# EAGLE design SCHEM2 (EAGLE 7.2.0)
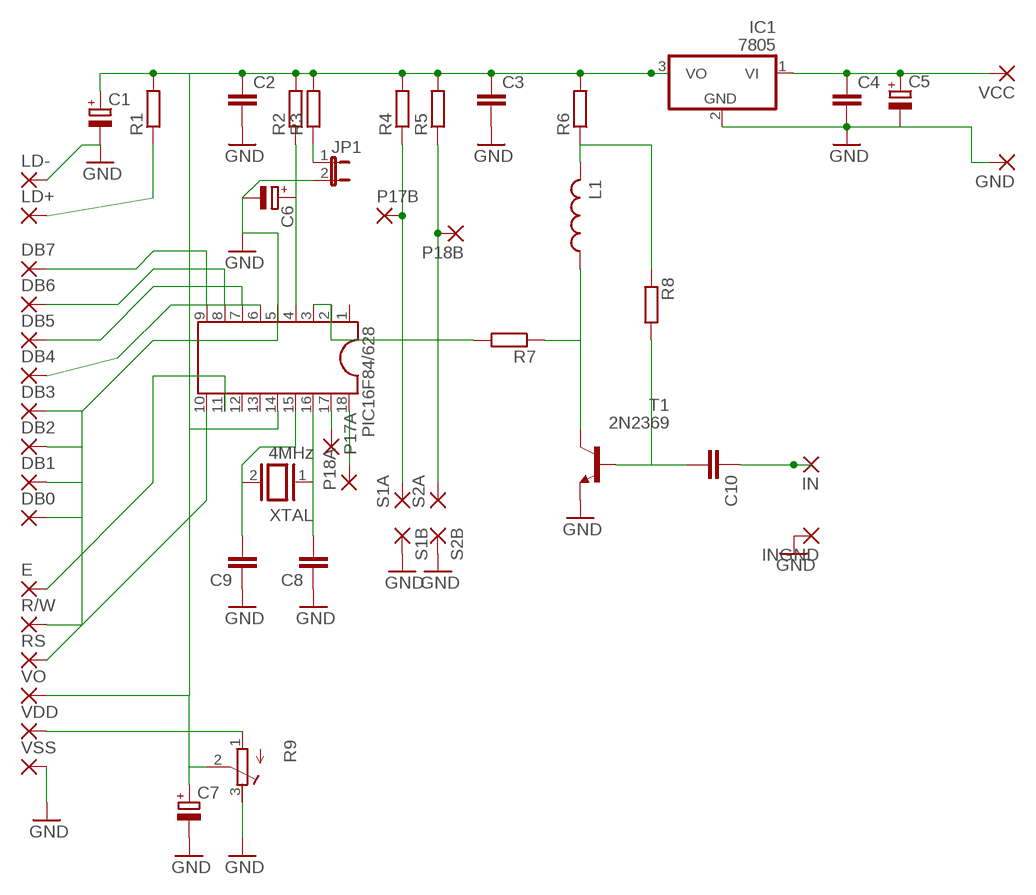
[diagram p0: schematic, sheet 1]

## Parts
C1  CPOL-EUE3.5-8  [E3,5-8]
C2  C-EU025-040X050  [C025-040X050]
C3  C-EU025-040X050  [C025-040X050]
C4  C-EU025-040X050  [C025-040X050]
C5  CPOL-EUE3.5-8  [E3,5-8]
C6  CPOL-EUE3.5-8  [E3,5-8]
C7  CPOL-EUE3.5-8  [E3,5-8]
C8  C-EU025-040X050  [C025-040X050]
C9  C-EU025-040X050  [C025-040X050]
C10  C-EU025-040X050  [C025-040X050]
DB0  WIREPAD1,6/0,8  [1,6/0,8]
DB1  WIREPAD1,6/0,8  [1,6/0,8]
DB2  WIREPAD1,6/0,8  [1,6/0,8]
DB3  WIREPAD1,6/0,8  [1,6/0,8]
DB4  WIREPAD1,6/0,8  [1,6/0,8]
DB5  WIREPAD1,6/0,8  [1,6/0,8]
DB6  WIREPAD1,6/0,8  [1,6/0,8]
DB7  WIREPAD1,6/0,8  [1,6/0,8]
E  WIREPAD1,6/0,8  [1,6/0,8]
GND  WIREPAD1,6/0,8  [1,6/0,8]
IC1  7805  788TV  [TO220V]
IN  WIREPAD1,6/0,8  [1,6/0,8]
INGND  WIREPAD1,6/0,8  [1,6/0,8]
JP1  JP1E  [JP1]
L1  L-US0204/7  [0204/7]
LD+  WIREPAD1,6/0,8  [1,6/0,8]
LD-  WIREPAD1,6/0,8  [1,6/0,8]
P17A  WIREPAD1,6/0,8  [1,6/0,8]
P17B  WIREPAD1,6/0,8  [1,6/0,8]
P18A  WIREPAD1,6/0,8  [1,6/0,8]
P18B  WIREPAD1,6/0,8  [1,6/0,8]
PIC16F84/628  DIL18  [DIL18]
R1  R-EU_0204/5  [0204/5]
R2  R-EU_0204/5  [0204/5]
R3  R-EU_0204/5  [0204/5]
R4  R-EU_0204/5  [0204/5]
R5  R-EU_0204/5  [0204/5]
R6  R-EU_0204/5  [0204/5]
R7  R-EU_0204/5  [0204/5]
R8  R-EU_0204/5  [0204/5]
R9  R-TRIMM3339P  [RTRIM3339P]
R/W  WIREPAD1,6/0,8  [1,6/0,8]
RS  WIREPAD1,6/0,8  [1,6/0,8]
S1A  WIREPAD1,6/0,8  [1,6/0,8]
S1B  WIREPAD1,6/0,8  [1,6/0,8]
S2A  WIREPAD1,6/0,8  [1,6/0,8]
S2B  WIREPAD1,6/0,8  [1,6/0,8]
T1  2N2369  [TO18]
VCC  WIREPAD1,6/0,8  [1,6/0,8]
VDD  WIREPAD1,6/0,8  [1,6/0,8]
VO  WIREPAD1,6/0,8  [1,6/0,8]
VSS  WIREPAD1,6/0,8  [1,6/0,8]
XTAL  4MHz  XTAL/S  [QS]

## Nets
GND: C1.- C2.2 C3.2 C4.2 C5.- C6.- C7.- C8.1 C9.1 DB0.1(P) DB1.1(P) DB2.1(P) DB3.1(P) GND.1(P) IC1.2(GND) INGND.1(P) JP1.2 LD-.1(P) PIC16F84/628.5 R9.3(E) R/W.1(P) S1B.1(P) S2B.1(P) T1.1(E) VSS.1(P)
N$1: C1.+ C2.1 C3.1 C7.+ IC1.3(VO) PIC16F84/628.14 R1.2 R2.2 R3.2 R4.2 R5.2 R6.2 R9.2(S) VO.1(P)
N$2: L1.2 R6.1 R8.1
N$3: C4.1 C5.+ IC1.1(VI) VCC.1(P)
N$4: JP1.1 R3.1
N$5: L1.1 R7.1 T1.3(C)
N$6: C10.2 R8.2 T1.2(B)
N$7: C10.1 IN.1(P)
N$8: DB4.1(P) PIC16F84/628.6
N$9: DB5.1(P) PIC16F84/628.7
N$10: LD+.1(P) R1.1
N$11: C6.+ PIC16F84/628.4 R2.1
N$12: DB6.1(P) PIC16F84/628.8
N$13: DB7.1(P) PIC16F84/628.9
N$14: PIC16F84/628.2 PIC16F84/628.3 R7.2
N$15: C9.2 PIC16F84/628.15 XTAL.2
N$16: C8.2 PIC16F84/628.16 XTAL.1
N$17: P18B.1(P) R5.1 S2A.1(P)
N$18: P17B.1(P) R4.1 S1A.1(P)
N$19: PIC16F84/628.10 RS.1(P)
N$20: P17A.1(P) PIC16F84/628.17
N$21: P18A.1(P) PIC16F84/628.18
N$22: R9.1(A) VDD.1(P)
N$24: E.1(P) PIC16F84/628.11
Unconnected: PIC16F84/628.1 PIC16F84/628.12 PIC16F84/628.13

## Library data of the parts
C1 C5-C7 = rcl:CPOL-EU: POLARIZED CAPACITOR, European symbol
C2-C4 C8-C10 = resistor:C-EU: CAPACITOR, European symbol
DB0 DB1-DB7 E GND IN INGND LD+ LD- P17A P17B P18A P18B R/W RS S1A S1B S2A S2B VCC VDD VO VSS = wirepad:WIREPAD: Wire PAD connect wire on PCB
IC1 = linear:78*: Positive VOLTAGE REGULATOR Source: http://cache.national.com/ds/LM/LM78L05.pdf http://www.fairchildsemi.com/ds/LM/LM7805.pdf
JP1 = jumper:JP1E: JUMPER
L1 = resistor:L-US: INDUCTOR, American symbol
PIC16F84/628 = ic-package:DIL18: Dual In Line / Socket
R1-R8 = resistor:R-EU_: RESISTOR, European symbol
R9 = rcl:R-TRIMM: Trimm resistor
T1 = transistor:2N2369: NPN TRANSISTOR
XTAL = special:XTAL/S: CRYSTAL

## Board
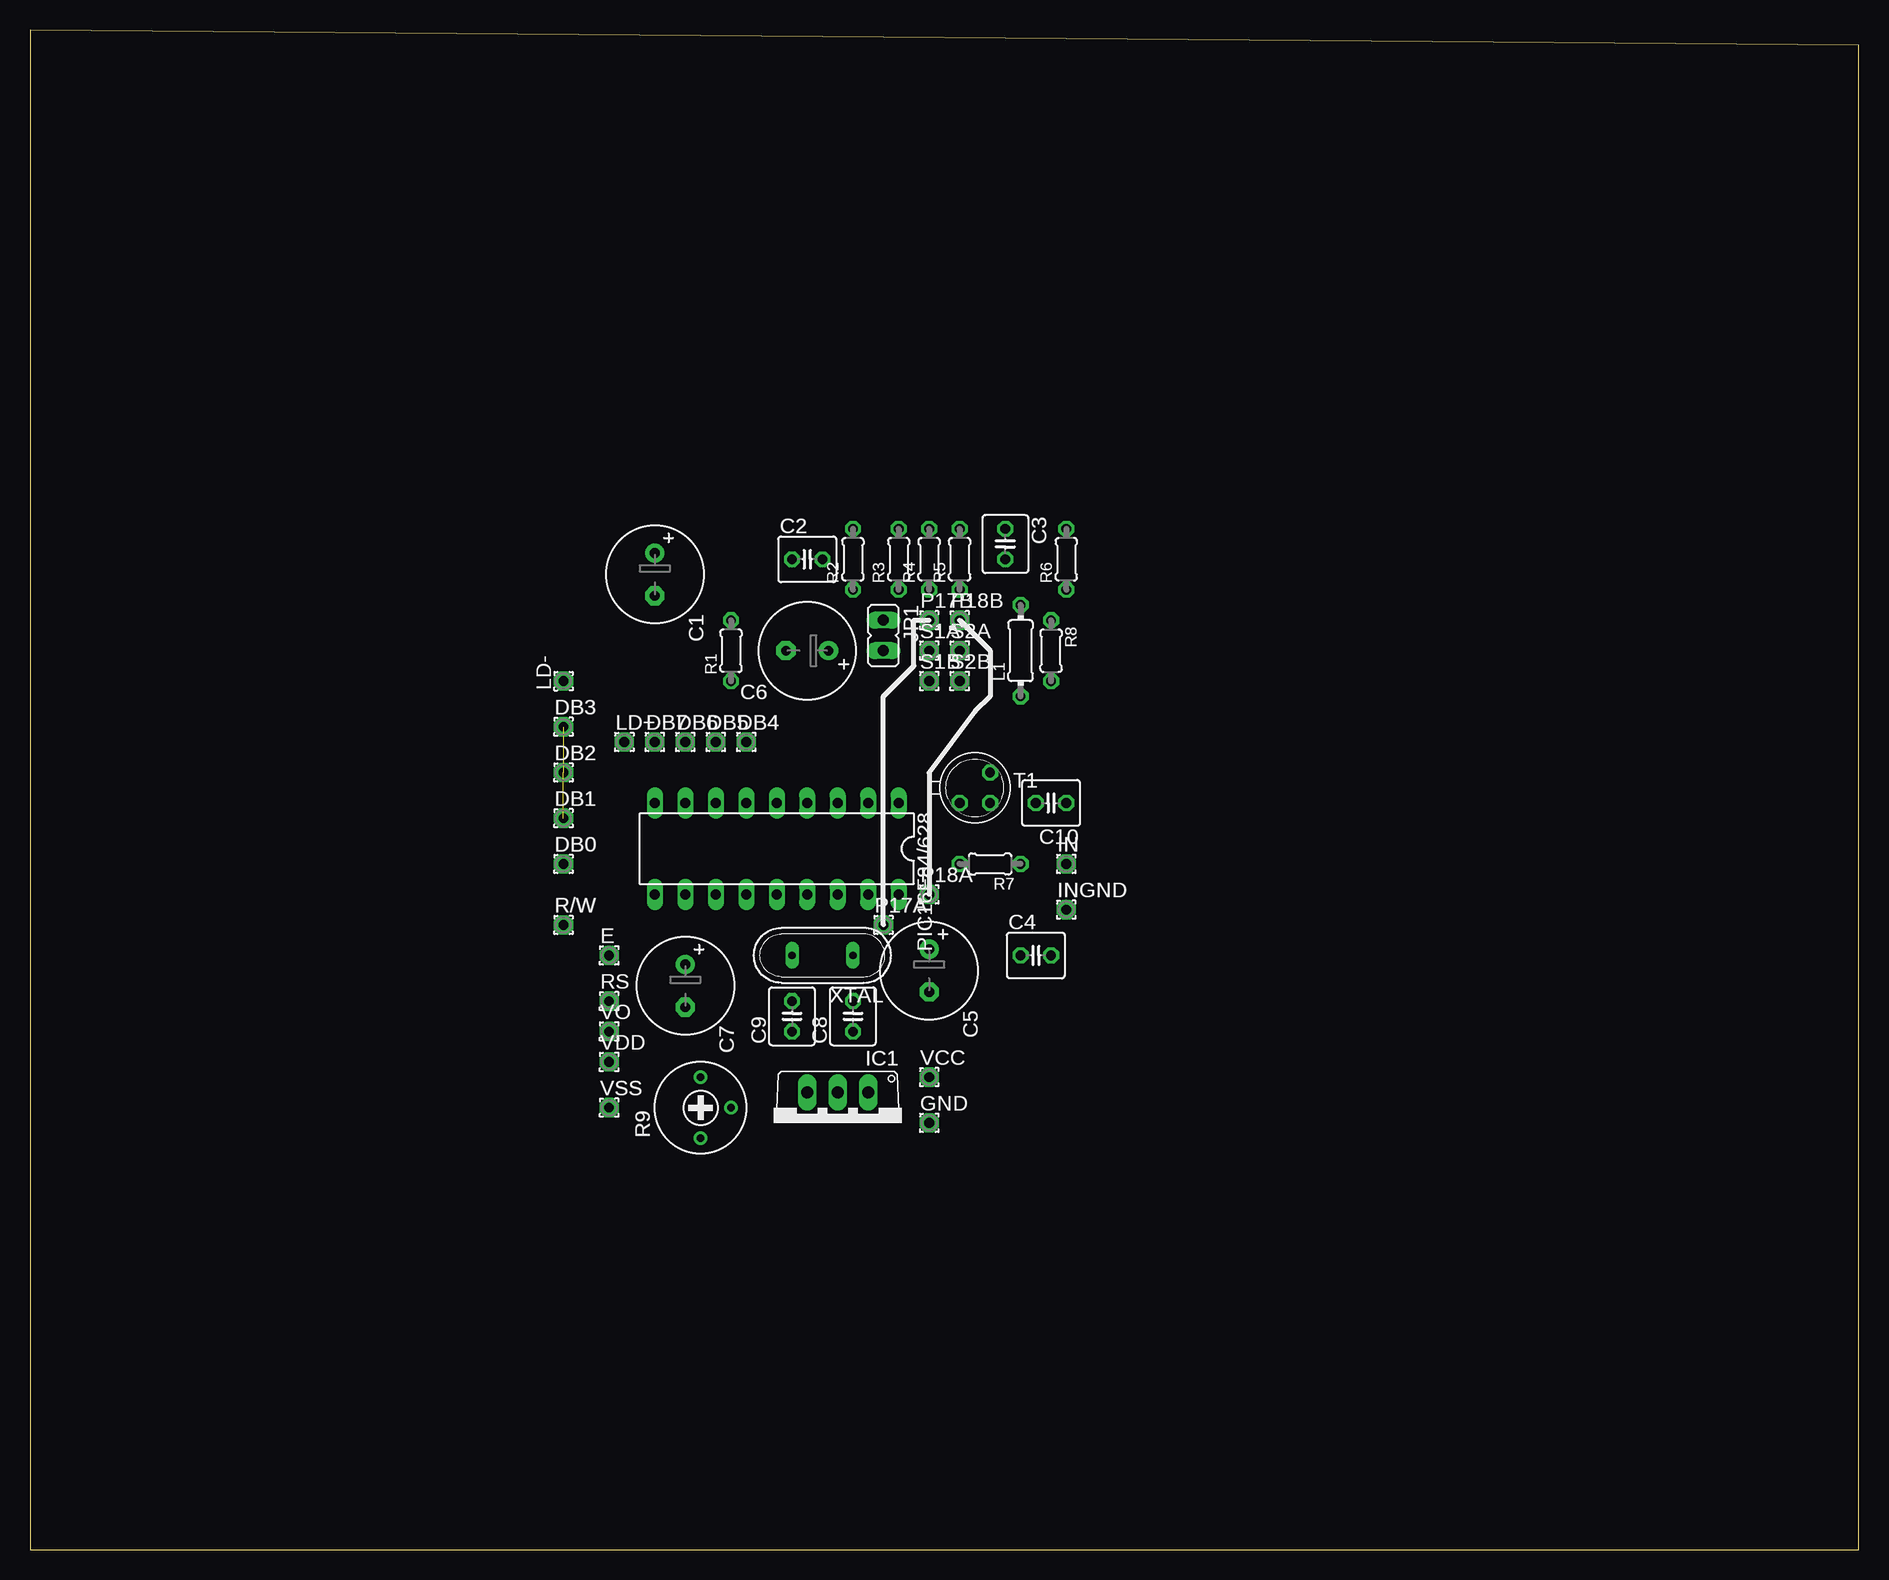
[diagram p1: board, top side]
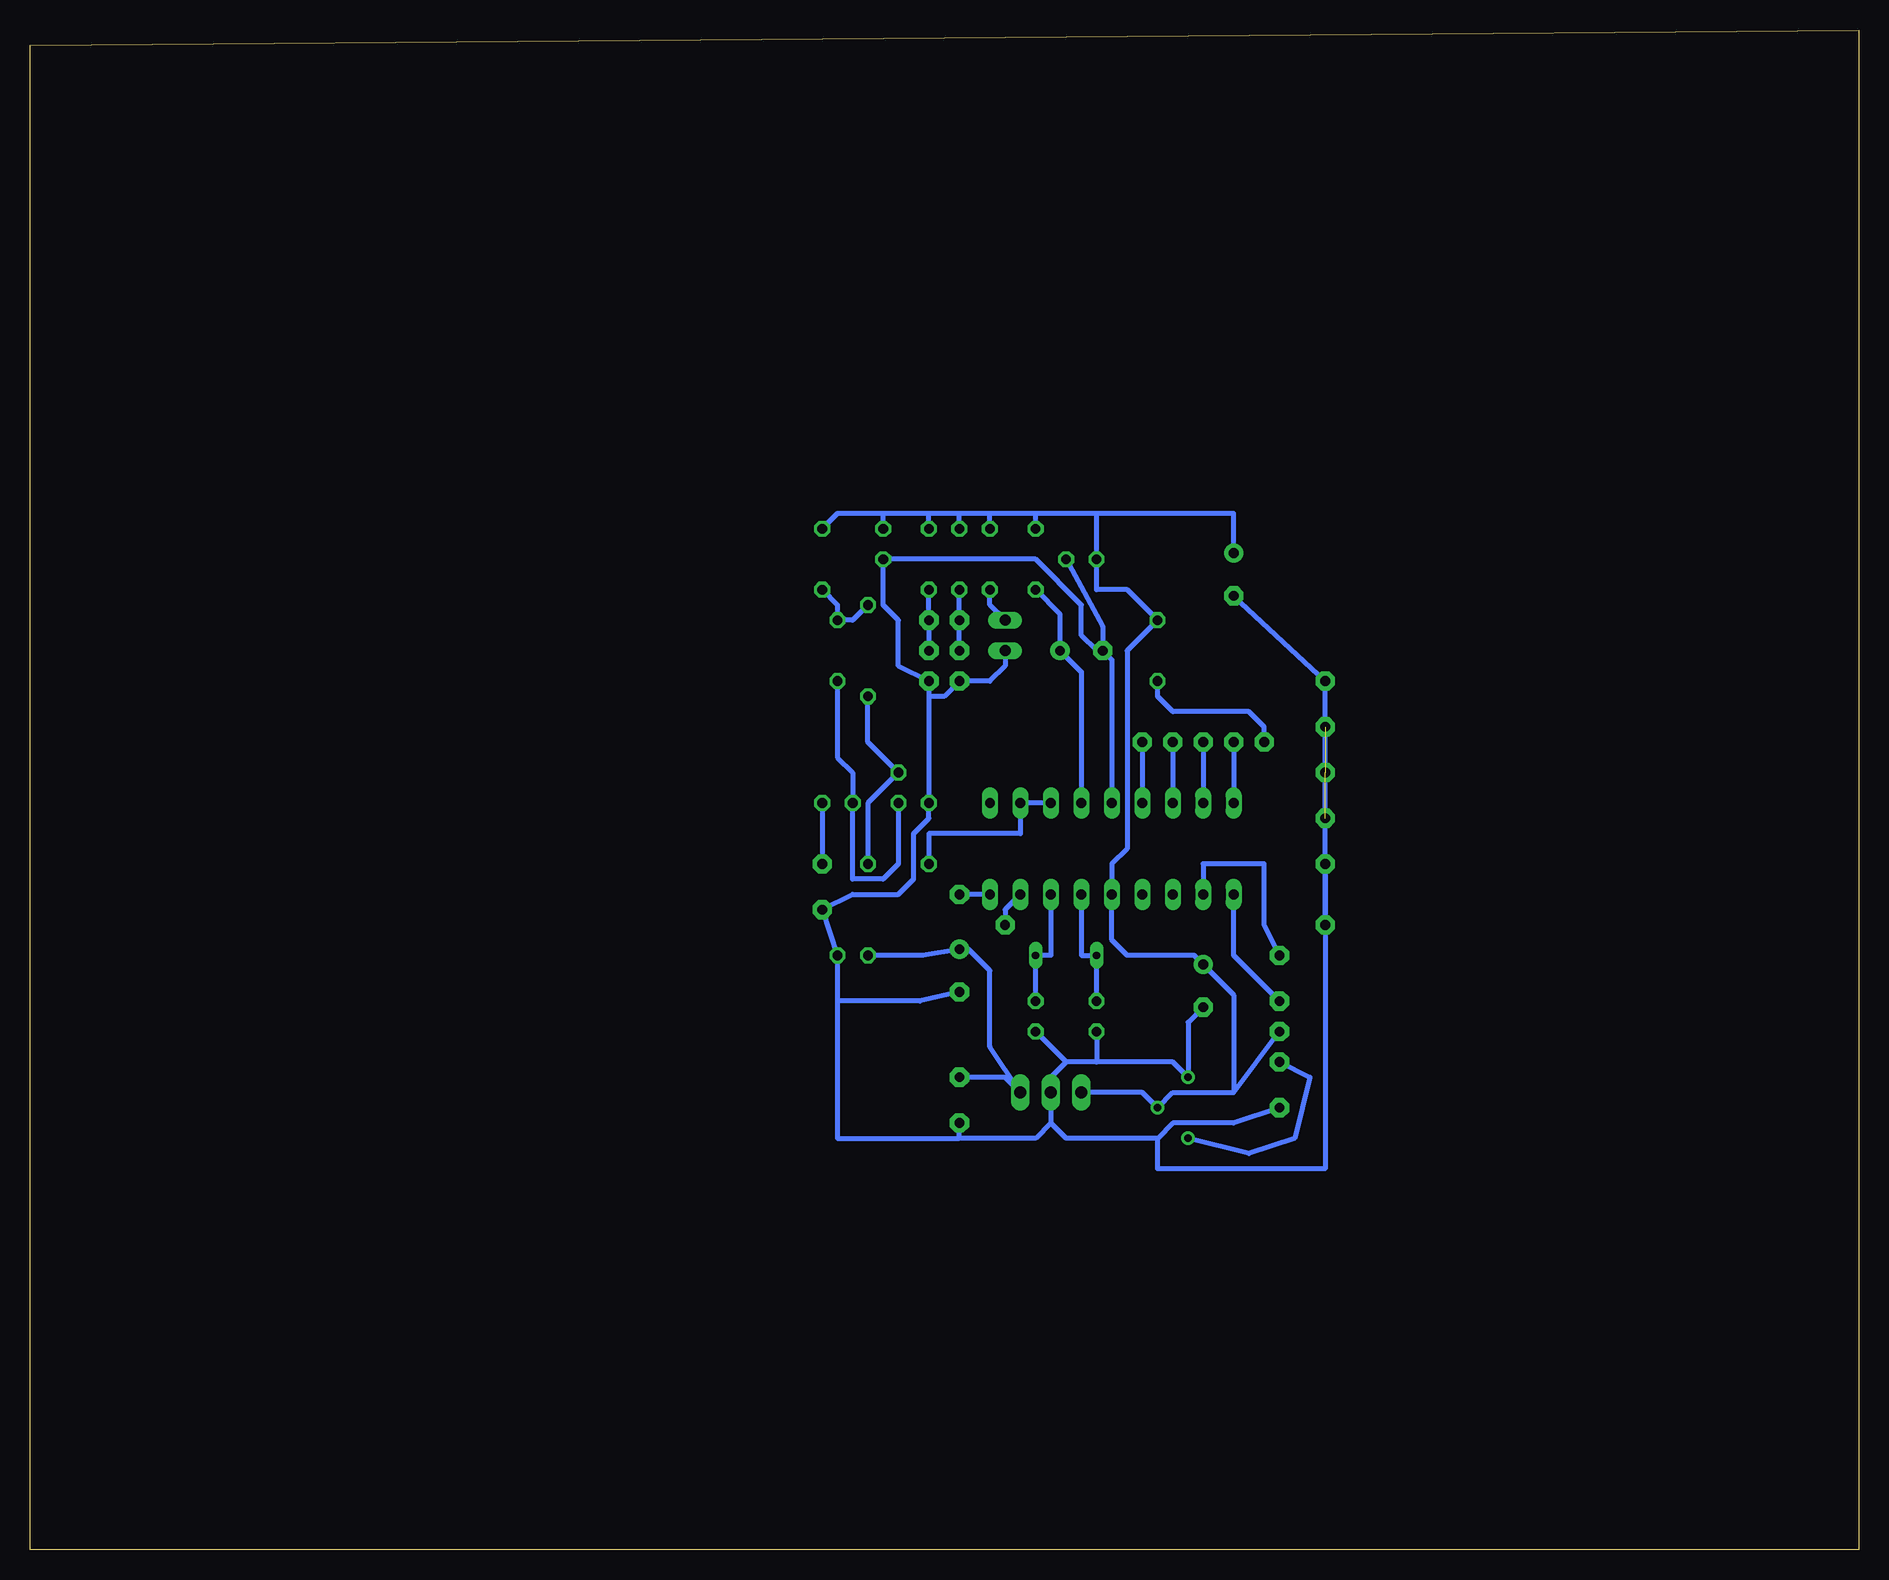
[diagram p2: board, bottom side, seen from below]

Size 152.38 x 126.67 mm. Coordinates in mm from the lower left corner, seen from the top.
Outline: 0,0 152.38,0 152.38,125.4 0,126.67 0,0
Copper layers (1*16): Top 0.035mm / dielectric 1.5mm / Bottom 0.035mm
Design rules "default": minimum track width 10mil, minimum drill 24mil, track to track 8mil, track to pad 8mil, pad to pad 8mil, via to via 8mil, smd to smd 8mil, copper to edge 40mil, drill to drill 8mil, minimum pad ring 10mil, minimum via ring 8mil, stop-mask expansion 4mil, vias tented up to drill 0mil, thermal gap 10mil

### Footprints (pad centres in the part's own frame; a part is rotated, then mirrored left to right if it is on the bottom)
E3,5-8 = drill 0.813 pad 1.6: + -1.778,0 | drill 0.813 pad 1.6 octagon: - 1.778,0
C025-040X050 = drill 0.813 octagon: 1 -1.27,0; 2 1.27,0
1,6/0,8 = drill 0.813 pad 1.6 octagon: 1 0,0
TO220V = drill 1.016 long: 1 -2.54,-2.54; 2 0,-2.54; 3 2.54,-2.54
JP1 = drill 0.914 long: 1 0,-1.27; 2 0,1.27
0204/7 = drill 0.813 octagon: 1 -3.81,0; 2 3.81,0
DIL18 = drill 0.813 long: 1 -10.16,-3.81; 2 -7.62,-3.81; 3 -5.08,-3.81; 4 -2.54,-3.81; 5 0,-3.81; 6 2.54,-3.81; 7 5.08,-3.81; 8 7.62,-3.81; 9 10.16,-3.81; 10 10.16,3.81; 11 7.62,3.81; 12 5.08,3.81; 13 2.54,3.81; 14 0,3.81; 15 -2.54,3.81; 16 -5.08,3.81; 17 -7.62,3.81; 18 -10.16,3.81
0204/5 = drill 0.813 octagon: 1 -2.54,0; 2 2.54,0
RTRIM3339P = drill 0.61: 1 -2.54,0; 2 0,-2.54; 3 2.54,0
TO18 = drill 0.813 octagon: 1 -1.27,-1.27; 2 1.27,-1.27; 3 1.27,1.27
QS = drill 0.61 long: 1 -2.54,0; 2 2.54,0

### Placement (x,y rotation side)
C1  52.07,81.28 270 top
C2  64.77,82.55 0 top
C3  81.28,83.82 270 top
C4  83.82,49.53 0 top
C5  74.93,48.26 270 top
C6  64.77,74.93 180 top
C7  54.61,46.99 270 top
C8  68.58,44.45 90 top
C9  63.5,44.45 90 top
C10  85.09,62.23 180 top
DB0  44.45,57.15 0 top
DB1  44.45,60.96 0 top
DB2  44.45,64.77 0 top
DB3  44.45,68.58 0 top
DB4  59.69,67.31 0 top
DB5  57.15,67.31 0 top
DB6  54.61,67.31 0 top
DB7  52.07,67.31 0 top
E  48.26,49.53 0 top
GND  74.93,35.56 0 top
IC1  67.31,35.56 180 top
IN  86.36,57.15 0 top
INGND  86.36,53.34 0 top
JP1  71.12,76.2 180 top
L1  82.55,74.93 90 top
LD+  49.53,67.31 0 top
LD-  44.45,72.39 90 top
P17A  71.12,52.07 0 top
P17B  74.93,77.47 0 top
P18A  74.93,54.61 0 top
P18B  77.47,77.47 0 top
PIC16F84/628  62.23,58.42 180 top
R1  58.42,74.93 90 top
R2  68.58,82.55 90 top
R3  72.39,82.55 90 top
R4  74.93,82.55 90 top
R5  77.47,82.55 90 top
R6  86.36,82.55 90 top
R7  80.01,57.15 180 top
R8  85.09,74.93 270 top
R9  55.88,36.83 90 top
R/W  44.45,52.07 0 top
RS  48.26,45.72 0 top
S1A  74.93,74.93 0 top
S1B  74.93,72.39 0 top
S2A  77.47,74.93 0 top
S2B  77.47,72.39 0 top
T1  78.74,63.5 0 top
VCC  74.93,39.37 0 top
VDD  48.26,40.64 0 top
VO  48.26,43.18 0 top
VSS  48.26,36.83 0 top
XTAL  66.04,49.53 180 top

### Tracks (layer width: path | path; a pad name or v marks a point on that pad's centre or on a via)
GND  (2 unrouted)
  Bottom 0.406: 54.61,45.72 C7.- 55.88,43.94 R9.3 57.15,40.64 63.5,40.64 | VSS.1 52.07,35.56 57.15,35.56 58.42,34.29 | 58.42,34.29 66.04,34.29 67.31,35.56 | 67.31,35.56 IC1.2 67.31,39.37 66.04,40.64 | 67.31,35.56 68.58,34.29 74.93,34.29 | 74.93,34.29 GND.1 | 63.5,40.64 66.04,40.64 | 66.04,40.64 C8.1 | C9.1 63.5,40.64 | C5.- 78.23,45.72 85.09,45.72 | 85.09,45.72 C4.2 INGND.1 83.82,54.61 80.01,54.61 78.74,55.88 78.74,59.69 77.47,60.96 T1.1 77.47,71.12 | 85.09,45.72 85.09,34.29 74.93,34.29 | 77.47,71.12 S2B.1 80.01,73.66 80.01,77.47 81.28,78.74 C3.2 68.58,82.55 64.77,78.74 64.77,76.2 63.5,74.93 C6.- | JP1.2 71.12,73.66 72.39,72.39 S1B.1 76.2,71.12 77.47,71.12 | C1.- LD-.1 DB3.1 DB0.1 | C2.2 62.99,76.96 C6.- | C6.- 62.23,74.17 PIC16F84/628.5 | R/W.1 DB0.1 | DB0.1 44.45,31.75 58.42,31.75 58.42,34.29
N$1
  Bottom 0.406: C1.+ 52.07,86.36 63.5,86.36 | 63.5,86.36 68.58,86.36 | 68.58,86.36 72.39,86.36 | 72.39,86.36 74.93,86.36 | 74.93,86.36 77.47,86.36 | 77.47,86.36 81.28,86.36 | 81.28,86.36 85.09,86.36 R6.2 | R2.2 68.58,86.36 | R3.2 72.39,86.36 | R4.2 74.93,86.36 | R5.2 77.47,86.36 | C3.1 81.28,86.36 | 63.5,86.36 C2.1 63.5,80.01 60.96,80.01 R1.2 60.96,74.93 60.96,58.42 62.23,57.15 PIC16F84/628.14 62.23,50.8 60.96,49.53 55.37,49.53 C7.+ 52.07,46.23 52.07,38.1 | 52.07,38.1 57.15,38.1 R9.2 59.69,38.1 IC1.3 | 52.07,38.1 VO.1
N$2
  Bottom 0.406: L1.2 83.82,77.47 R8.1 85.09,78.74 R6.1
N$3
  Bottom 0.406: VCC.1 71.12,39.37 IC1.1 72.39,41.91 72.39,48.26 74.17,50.04 C5.+ 77.98,49.53 C4.1
N$4
  Bottom 0.406: JP1.1 72.39,78.74 R3.1
N$5
  Bottom 0.406: L1.1 82.55,67.31 T1.3 82.55,62.23 R7.1
N$6
  Bottom 0.406: R8.2 85.09,66.04 83.82,64.77 C10.2 83.82,55.88 81.28,55.88 80.01,57.15 T1.2
N$7
  Bottom 0.406: C10.1 IN.1
N$8
  Bottom 0.406: DB4.1 PIC16F84/628.6
N$9
  Bottom 0.406: DB5.1 PIC16F84/628.7
N$10
  Bottom 0.406: LD+.1 49.53,68.58 50.8,69.85 57.15,69.85 58.42,71.12 R1.1
N$11
  Bottom 0.406: R2.1 66.55,77.98 C6.+ 64.77,73.15 PIC16F84/628.4
N$12
  Bottom 0.406: DB6.1 PIC16F84/628.8
N$13
  Bottom 0.406: DB7.1 PIC16F84/628.9
N$14
  Bottom 0.406: PIC16F84/628.3 PIC16F84/628.2 69.85,59.69 77.47,59.69 R7.2
N$15
  Bottom 0.406: PIC16F84/628.15 64.77,49.53 XTAL.2 C9.2
N$16
  Bottom 0.406: PIC16F84/628.16 67.31,49.53 XTAL.1 C8.2
N$17
  Bottom 0.406: R5.1 P18B.1 S2A.1
N$18
  Bottom 0.406: R4.1 P17B.1 S1A.1
N$19
  Bottom 0.406: RS.1 52.07,49.53 PIC16F84/628.10
N$20
  Bottom 0.406: PIC16F84/628.17 71.12,53.34 P17A.1
N$21
  Bottom 0.406: PIC16F84/628.18 P18A.1
N$22
  Bottom 0.406: VDD.1 45.72,39.37 46.99,34.29 50.8,33.02 R9.1
N$24
  Bottom 0.406: E.1 49.53,52.07 49.53,57.15 54.61,57.15 PIC16F84/628.11

### Text on the board
_tNames: C3 | C2 | R2 | R3 | R4 | R5 | R6 | JP1 | C1 | P17B | P18B | R8 | S1A | S2A | R1 | S1B | S2B | LD- | C6 | L1 | DB3 | LD+ | DB7 | DB6 | DB5 | DB4 | DB2 | T1 | DB1 | PIC16F84/628 | C10 | DB0 | IN | P18A | R7 | INGND | R/W | P17A | C4 | E | RS | XTAL | C5 | VO | C7 | VDD | C9 | C8 | IC1 | VCC | VSS | GND | R9